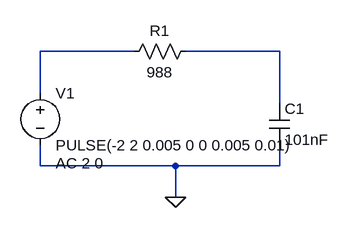
[diagram p0: schematic RC.asc]
RC.asc, the LTspice schematic file:
Version 4
SHEET 1 880 680
WIRE 176 32 32 32
WIRE 400 32 256 32
WIRE 32 96 32 32
WIRE 400 112 400 32
WIRE 32 208 32 176
WIRE 240 208 32 208
WIRE 400 208 400 176
WIRE 400 208 240 208
WIRE 240 256 240 208
FLAG 240 256 0
SYMBOL voltage 32 80 R0
WINDOW 123 24 124 Left 2
WINDOW 39 0 0 Left 0
SYMATTR InstName V1
SYMATTR Value PULSE(-2 2 0.005 0 0 0.005 0.01)
SYMATTR Value2 AC 2 0
SYMBOL res 272 16 R90
WINDOW 0 0 56 VBottom 2
WINDOW 3 32 56 VTop 2
SYMATTR InstName R1
SYMATTR Value 988
SYMBOL cap 384 112 R0
SYMATTR InstName C1
SYMATTR Value 101nF

The netlist it stands for:
* RC.asc
V1 N001 0 PULSE(-2 2 0.005 0 0 0.005 0.01) AC 2 0
R1 N002 N001 988
C1 N002 0 101nF
.backanno
.end